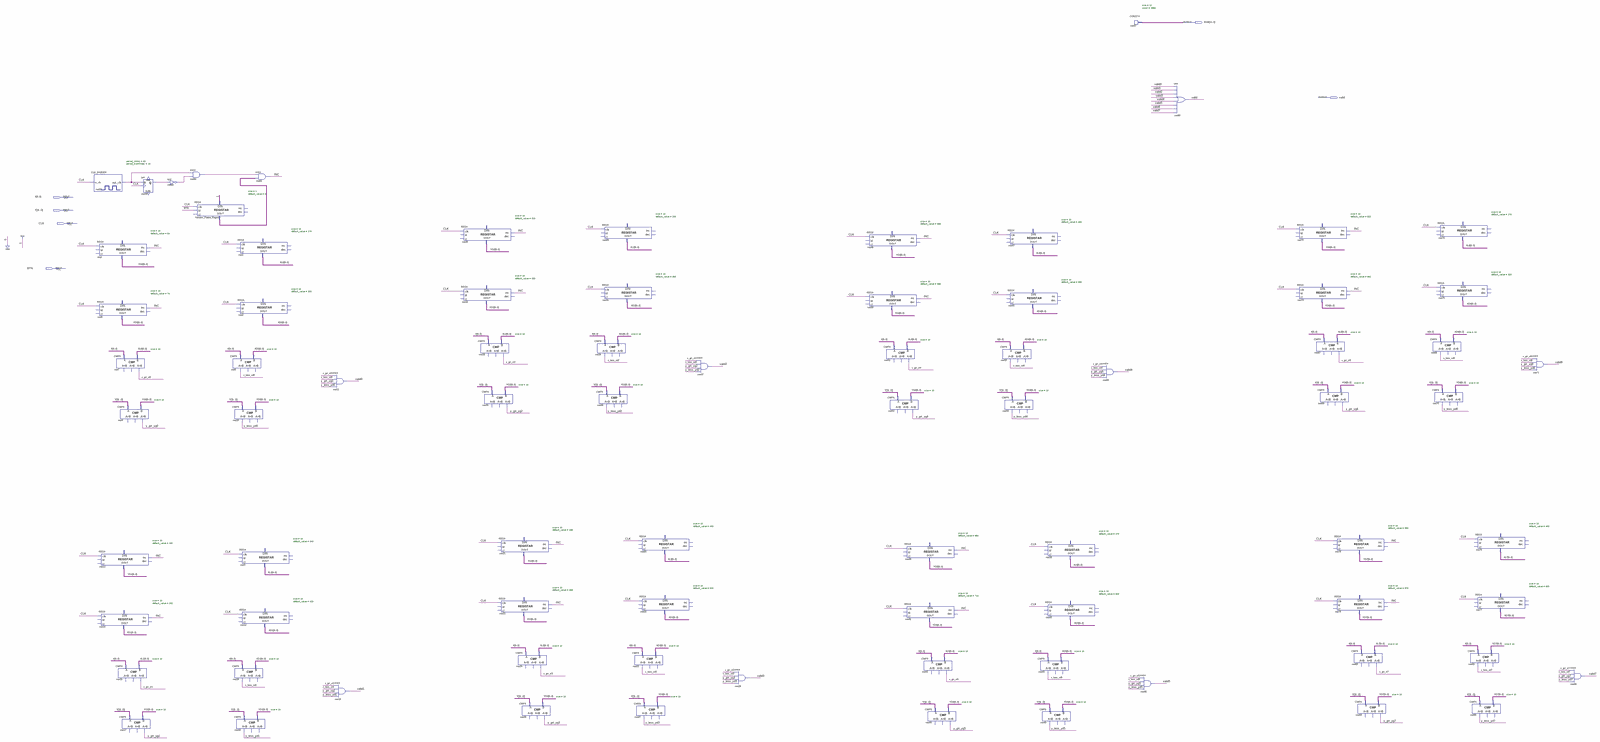
[diagram p0: schematic sheet, whole]
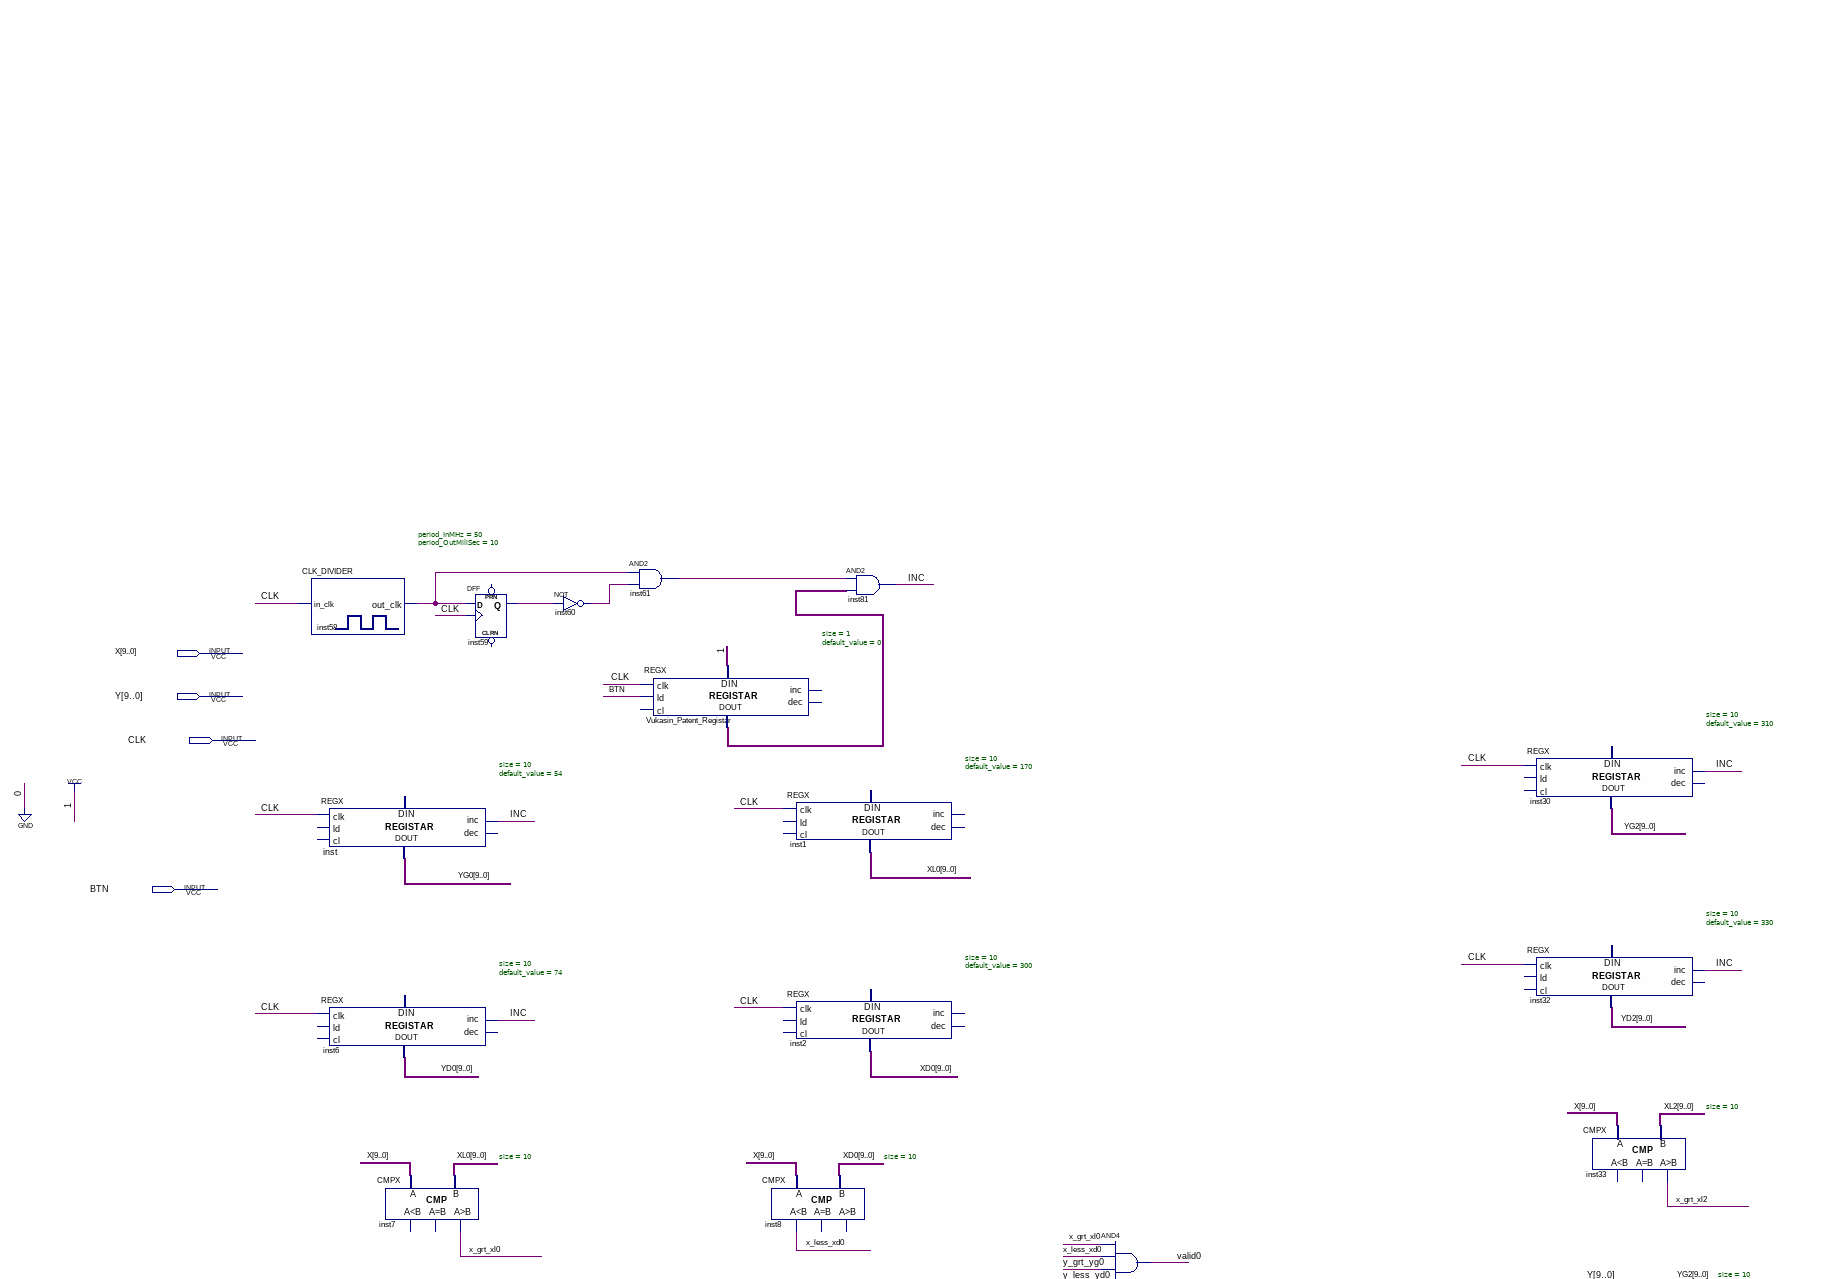
[diagram p1: schematic sheet, upper left part]
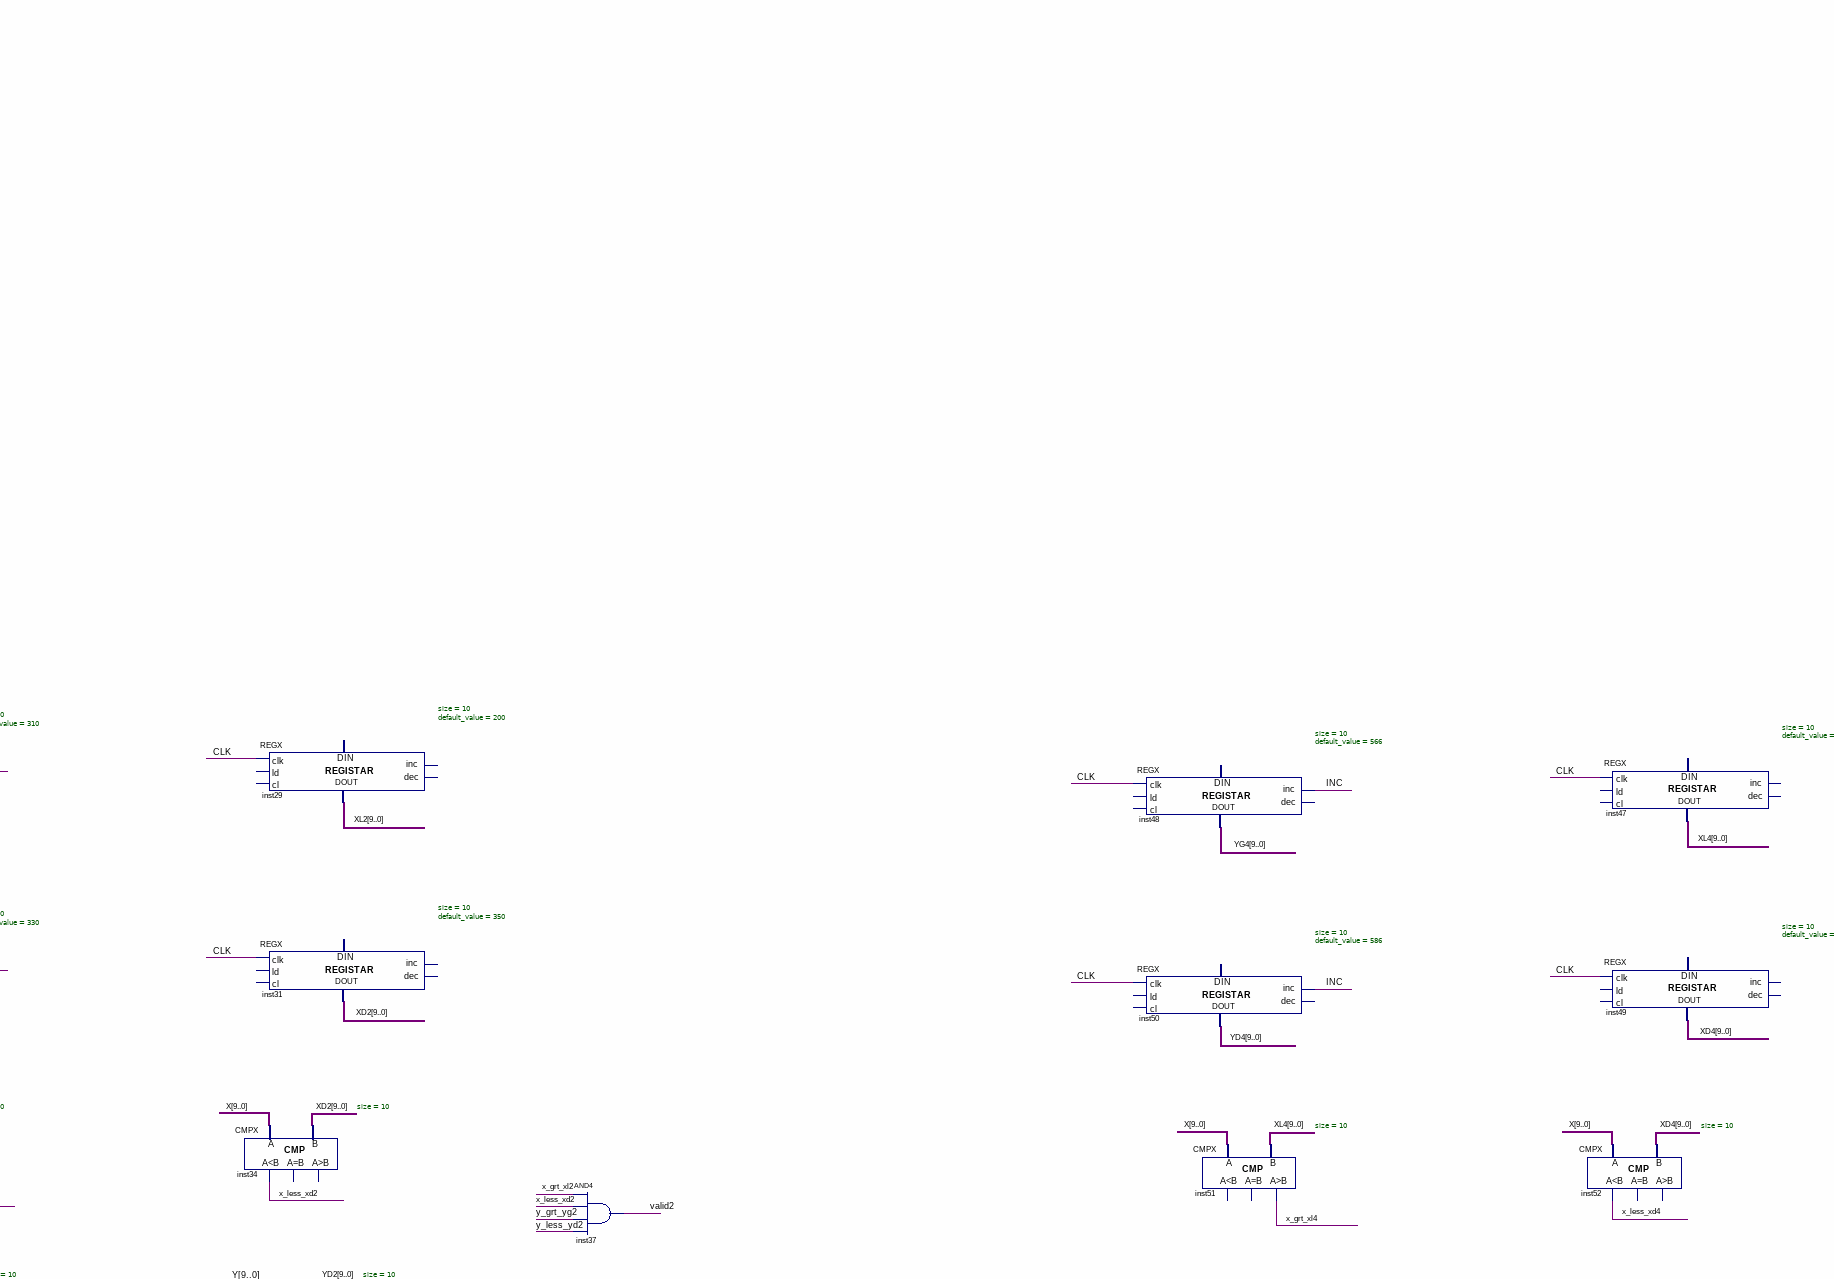
[diagram p2: schematic sheet, upper centre part]
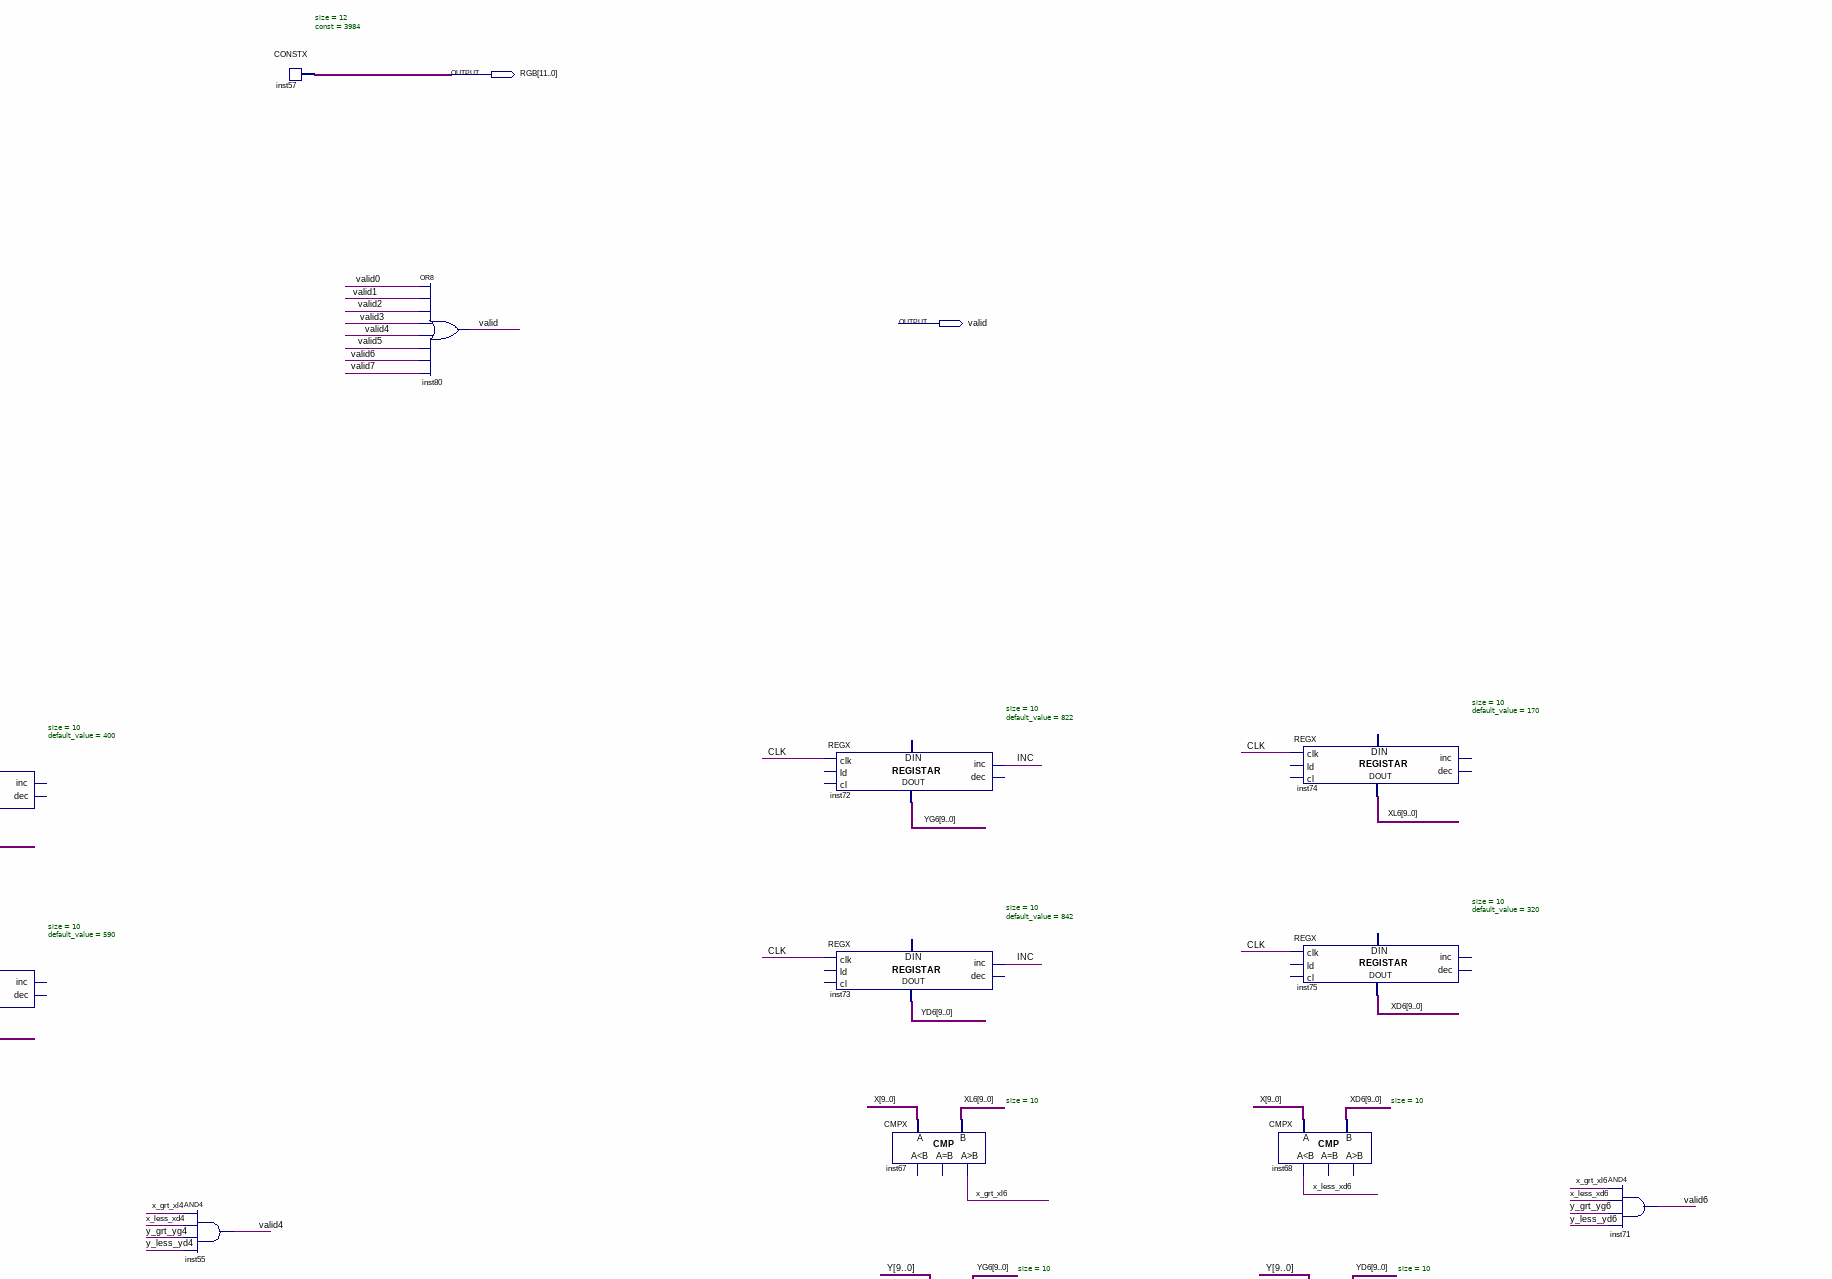
[diagram p3: schematic sheet, upper right part]
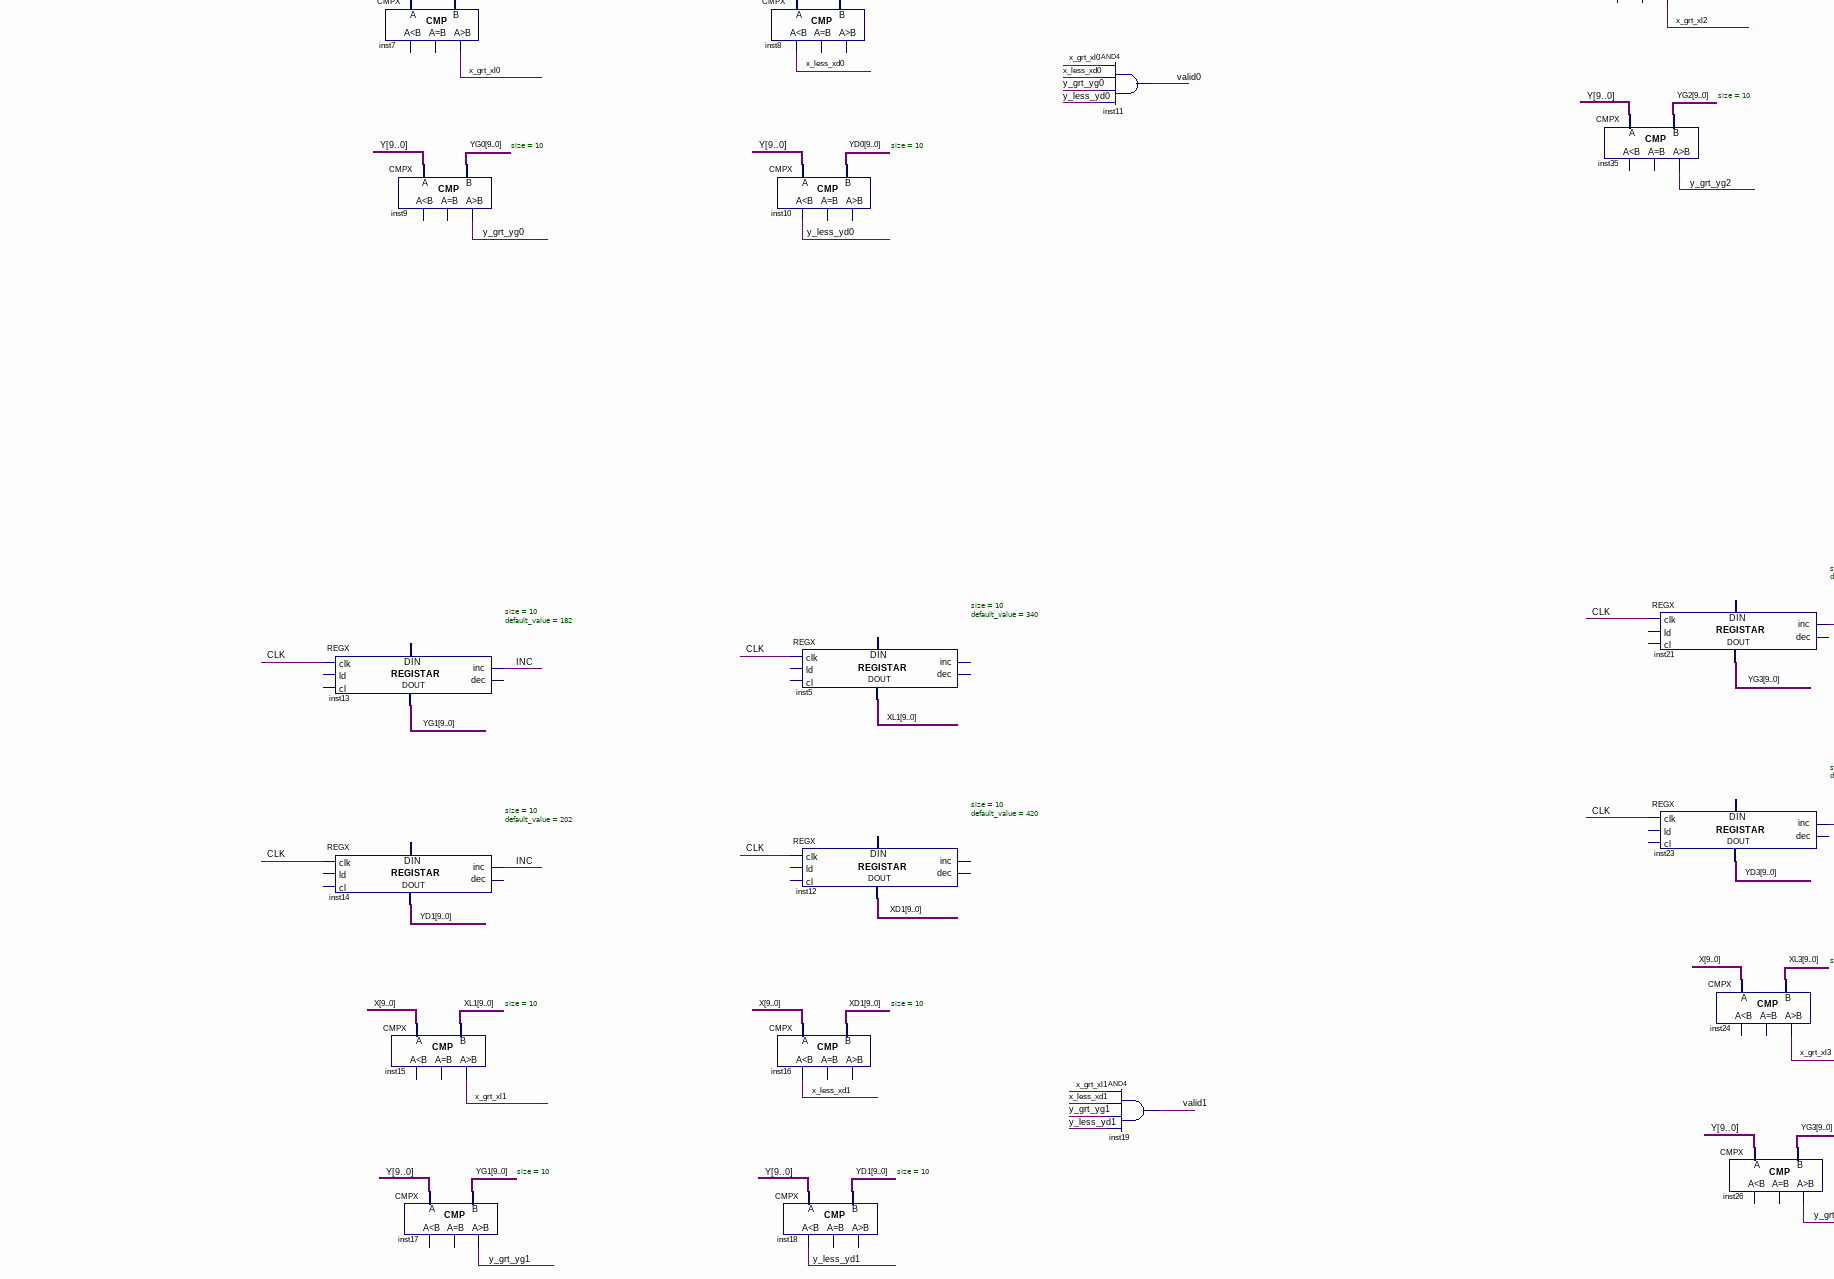
[diagram p4: schematic sheet, lower left part]
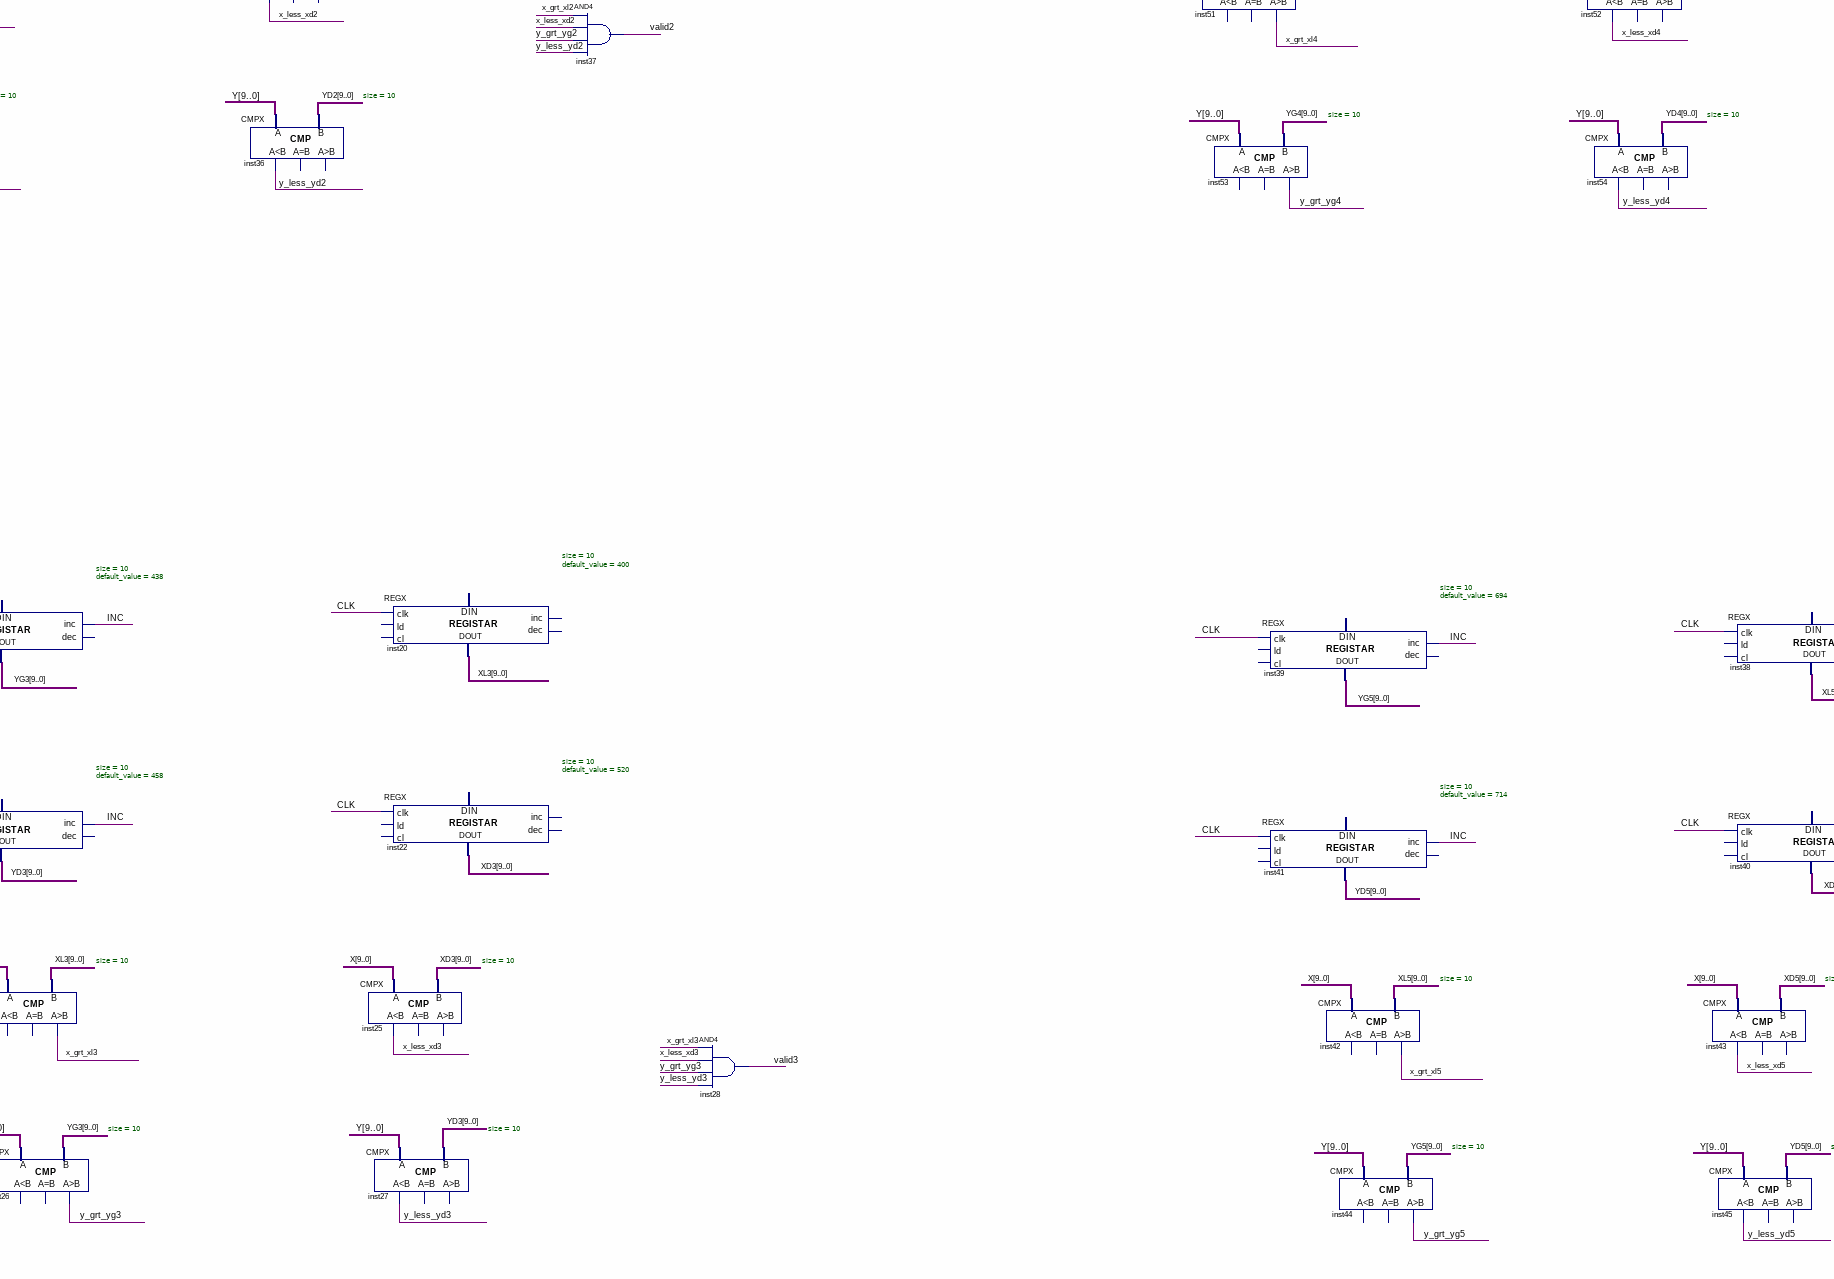
[diagram p5: schematic sheet, lower centre part]
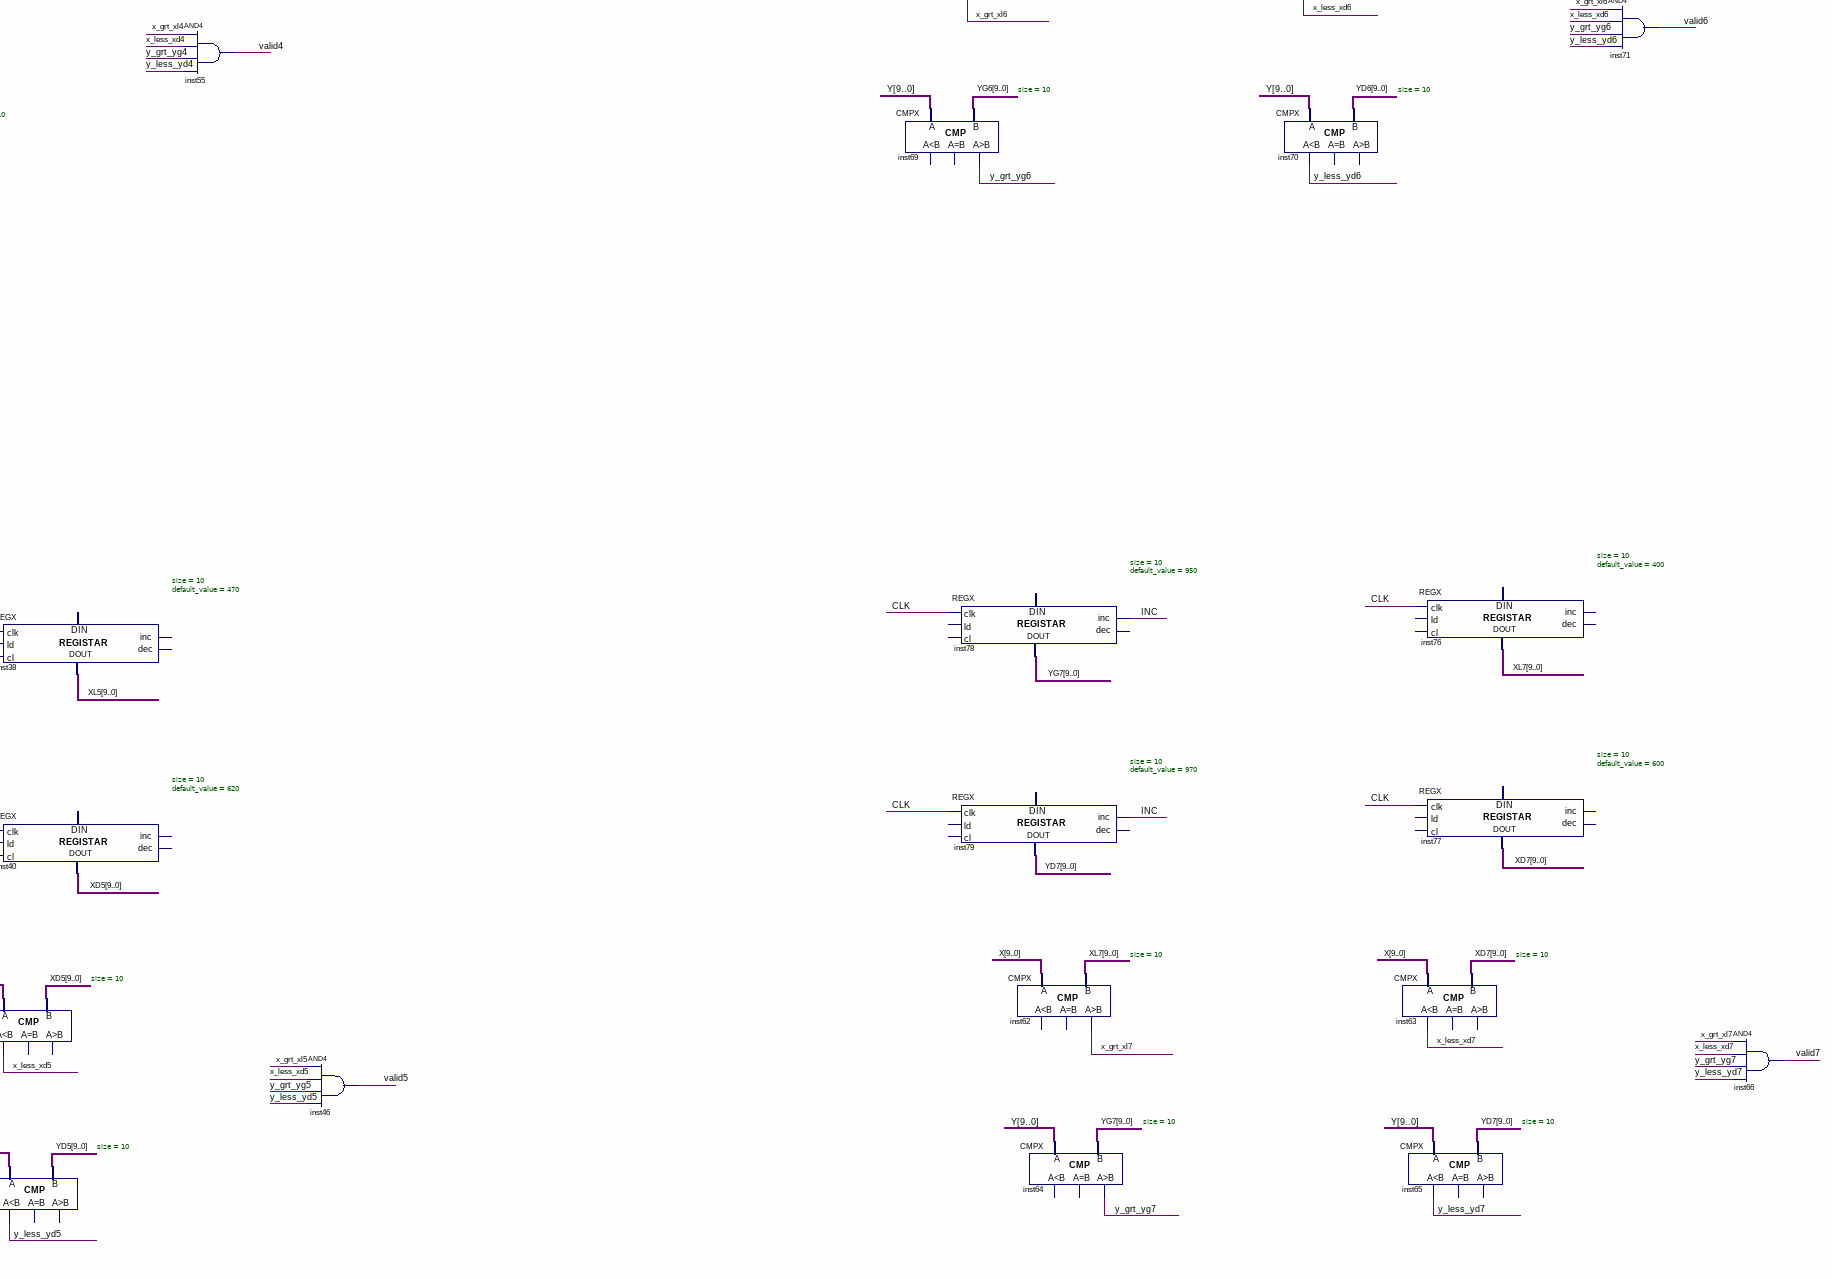
[diagram p6: schematic sheet, lower right part]
// Quartus schematic plocice.bdf as structural Verilog: 80 symbols, 6 pins
module plocice (
  input  [9:0] X,
  input  [9:0] Y,
  input  CLK,
  input  BTN,
  output [11:0] RGB,
  output valid
);

  wire INC, inst58_out_clk, inst59_q, inst60_out, inst61_out, valid0, valid1, valid2, valid3, valid4, valid5,
       valid6, valid7, Vukasin_Patent_Registar_data_out, x_grt_xl0, x_grt_xl1, x_grt_xl2, x_grt_xl3,
       x_grt_xl4, x_grt_xl5, x_grt_xl6, x_grt_xl7, x_less_xd0, x_less_xd1, x_less_xd2, x_less_xd3,
       x_less_xd4, x_less_xd5, x_less_xd6, x_less_xd7, y_grt_yg0, y_grt_yg1, y_grt_yg2, y_grt_yg3, y_grt_yg4,
       y_grt_yg5, y_grt_yg6, y_grt_yg7, y_less_yd0, y_less_yd1, y_less_yd2, y_less_yd3, y_less_yd4,
       y_less_yd5, y_less_yd6, y_less_yd7;
  wire [9:0] XD0, XD1, XD2, XD3, XD4, XD5, XD6, XD7, XL0, XL1, XL2, XL3, XL4, XL5, XL6, XL7, YD0, YD1, YD2,
       YD3, YD4, YD5, YD6, YD7, YG0, YG1, YG2, YG3, YG4, YG5, YG6, YG7;

  CLK_DIVIDER #(.period_InMHz(50), .period_OutMiliSec(10)) inst58 (.in_clk(CLK), .out_clk(inst58_out_clk));
  REGX #(.size(10), .default_value(54)) inst (.clk(CLK), .inc(INC), .data_out(YG0));  // open: ld, cl, dec, data_in
  REGX #(.size(10), .default_value(74)) inst6 (.clk(CLK), .inc(INC), .data_out(YD0));  // open: ld, cl, dec, data_in
  REGX #(.size(10), .default_value(182)) inst13 (.clk(CLK), .inc(INC), .data_out(YG1));  // open: ld, cl, dec, data_in
  REGX #(.size(10), .default_value(202)) inst14 (.clk(CLK), .inc(INC), .data_out(YD1));  // open: ld, cl, dec, data_in
  CMPX #(.size(10)) inst7 (.A(X), .B(XL0), .gr(x_grt_xl0));  // open: ls, eq
  CMPX #(.size(10)) inst9 (.A(Y), .B(YG0), .gr(y_grt_yg0));  // open: ls, eq
  CMPX #(.size(10)) inst15 (.A(X), .B(XL1), .gr(x_grt_xl1));  // open: ls, eq
  CMPX #(.size(10)) inst17 (.A(Y), .B(YG1), .gr(y_grt_yg1));  // open: ls, eq
  DFF inst59 (.CLK(CLK), .D(inst58_out_clk), .Q(inst59_q));  // open: CLRN, PRN
  not inst60 (inst60_out, inst59_q);
  and inst61 (inst61_out, inst58_out_clk, inst60_out);
  REGX #(.size(1), .default_value(0)) Vukasin_Patent_Registar (
    .clk(CLK), .ld(BTN), .data_in(1'b1), .data_out(Vukasin_Patent_Registar_data_out));  // open: cl, inc, dec
  CMPX #(.size(10)) inst8 (.A(X), .B(XD0), .ls(x_less_xd0));  // open: eq, gr
  REGX #(.size(10), .default_value(170)) inst1 (.clk(CLK), .data_out(XL0));  // open: ld, cl, inc, dec, data_in
  REGX #(.size(10), .default_value(300)) inst2 (.clk(CLK), .data_out(XD0));  // open: ld, cl, inc, dec, data_in
  CMPX #(.size(10)) inst10 (.A(Y), .B(YD0), .ls(y_less_yd0));  // open: eq, gr
  REGX #(.size(10), .default_value(340)) inst5 (.clk(CLK), .data_out(XL1));  // open: ld, cl, inc, dec, data_in
  REGX #(.size(10), .default_value(420)) inst12 (.clk(CLK), .data_out(XD1));  // open: ld, cl, inc, dec, data_in
  CMPX #(.size(10)) inst16 (.A(X), .B(XD1), .ls(x_less_xd1));  // open: eq, gr
  CMPX #(.size(10)) inst18 (.A(Y), .B(YD1), .ls(y_less_yd1));  // open: eq, gr
  and inst81 (INC, inst61_out, Vukasin_Patent_Registar_data_out);
  and inst11 (valid0, x_grt_xl0, x_less_xd0, y_grt_yg0, y_less_yd0);
  and inst19 (valid1, x_grt_xl1, x_less_xd1, y_grt_yg1, y_less_yd1);
  REGX #(.size(10), .default_value(310)) inst30 (.clk(CLK), .inc(INC), .data_out(YG2));  // open: ld, cl, dec, data_in
  REGX #(.size(10), .default_value(330)) inst32 (.clk(CLK), .inc(INC), .data_out(YD2));  // open: ld, cl, dec, data_in
  CMPX #(.size(10)) inst33 (.A(X), .B(XL2), .gr(x_grt_xl2));  // open: ls, eq
  CMPX #(.size(10)) inst35 (.A(Y), .B(YG2), .gr(y_grt_yg2));  // open: ls, eq
  REGX #(.size(10), .default_value(438)) inst21 (.clk(CLK), .inc(INC), .data_out(YG3));  // open: ld, cl, dec, data_in
  REGX #(.size(10), .default_value(458)) inst23 (.clk(CLK), .inc(INC), .data_out(YD3));  // open: ld, cl, dec, data_in
  CMPX #(.size(10)) inst24 (.A(X), .B(XL3), .gr(x_grt_xl3));  // open: ls, eq
  CMPX #(.size(10)) inst26 (.A(Y), .B(YG3), .gr(y_grt_yg3));  // open: ls, eq
  REGX #(.size(10), .default_value(200)) inst29 (.clk(CLK), .data_out(XL2));  // open: ld, cl, inc, dec, data_in
  REGX #(.size(10), .default_value(350)) inst31 (.clk(CLK), .data_out(XD2));  // open: ld, cl, inc, dec, data_in
  CMPX #(.size(10)) inst34 (.A(X), .B(XD2), .ls(x_less_xd2));  // open: eq, gr
  CMPX #(.size(10)) inst36 (.A(Y), .B(YD2), .ls(y_less_yd2));  // open: eq, gr
  CMPX #(.size(10)) inst25 (.A(X), .B(XD3), .ls(x_less_xd3));  // open: eq, gr
  CMPX #(.size(10)) inst27 (.A(Y), .B(YD3), .ls(y_less_yd3));  // open: eq, gr
  REGX #(.size(10), .default_value(400)) inst20 (.clk(CLK), .data_out(XL3));  // open: ld, cl, inc, dec, data_in
  REGX #(.size(10), .default_value(520)) inst22 (.clk(CLK), .data_out(XD3));  // open: ld, cl, inc, dec, data_in
  and inst37 (valid2, x_grt_xl2, x_less_xd2, y_grt_yg2, y_less_yd2);
  and inst28 (valid3, x_grt_xl3, x_less_xd3, y_grt_yg3, y_less_yd3);
  REGX #(.size(10), .default_value(566)) inst48 (.clk(CLK), .inc(INC), .data_out(YG4));  // open: ld, cl, dec, data_in
  REGX #(.size(10), .default_value(586)) inst50 (.clk(CLK), .inc(INC), .data_out(YD4));  // open: ld, cl, dec, data_in
  CMPX #(.size(10)) inst51 (.A(X), .B(XL4), .gr(x_grt_xl4));  // open: ls, eq
  CMPX #(.size(10)) inst53 (.A(Y), .B(YG4), .gr(y_grt_yg4));  // open: ls, eq
  REGX #(.size(10), .default_value(694)) inst39 (.clk(CLK), .inc(INC), .data_out(YG5));  // open: ld, cl, dec, data_in
  REGX #(.size(10), .default_value(714)) inst41 (.clk(CLK), .inc(INC), .data_out(YD5));  // open: ld, cl, dec, data_in
  CMPX #(.size(10)) inst42 (.A(X), .B(XL5), .gr(x_grt_xl5));  // open: ls, eq
  CMPX #(.size(10)) inst44 (.A(Y), .B(YG5), .gr(y_grt_yg5));  // open: ls, eq
  REGX #(.size(10), .default_value(400)) inst47 (.clk(CLK), .data_out(XL4));  // open: ld, cl, inc, dec, data_in
  REGX #(.size(10), .default_value(590)) inst49 (.clk(CLK), .data_out(XD4));  // open: ld, cl, inc, dec, data_in
  CMPX #(.size(10)) inst52 (.A(X), .B(XD4), .ls(x_less_xd4));  // open: eq, gr
  CMPX #(.size(10)) inst54 (.A(Y), .B(YD4), .ls(y_less_yd4));  // open: eq, gr
  CMPX #(.size(10)) inst43 (.A(X), .B(XD5), .ls(x_less_xd5));  // open: eq, gr
  CMPX #(.size(10)) inst45 (.A(Y), .B(YD5), .ls(y_less_yd5));  // open: eq, gr
  REGX #(.size(10), .default_value(470)) inst38 (.clk(CLK), .data_out(XL5));  // open: ld, cl, inc, dec, data_in
  REGX #(.size(10), .default_value(620)) inst40 (.clk(CLK), .data_out(XD5));  // open: ld, cl, inc, dec, data_in
  and inst55 (valid4, x_grt_xl4, x_less_xd4, y_grt_yg4, y_less_yd4);
  CONSTX #(.size(12), .\const (3984)) inst57 (.data(RGB));
  and inst46 (valid5, x_grt_xl5, x_less_xd5, y_grt_yg5, y_less_yd5);
  or inst80 (valid, valid0, valid1, valid2, valid3, valid4, valid5, valid6, valid7);
  REGX #(.size(10), .default_value(822)) inst72 (.clk(CLK), .inc(INC), .data_out(YG6));  // open: ld, cl, dec, data_in
  REGX #(.size(10), .default_value(842)) inst73 (.clk(CLK), .inc(INC), .data_out(YD6));  // open: ld, cl, dec, data_in
  CMPX #(.size(10)) inst67 (.A(X), .B(XL6), .gr(x_grt_xl6));  // open: ls, eq
  CMPX #(.size(10)) inst69 (.A(Y), .B(YG6), .gr(y_grt_yg6));  // open: ls, eq
  REGX #(.size(10), .default_value(950)) inst78 (.clk(CLK), .inc(INC), .data_out(YG7));  // open: ld, cl, dec, data_in
  REGX #(.size(10), .default_value(970)) inst79 (.clk(CLK), .inc(INC), .data_out(YD7));  // open: ld, cl, dec, data_in
  CMPX #(.size(10)) inst62 (.A(X), .B(XL7), .gr(x_grt_xl7));  // open: ls, eq
  CMPX #(.size(10)) inst64 (.A(Y), .B(YG7), .gr(y_grt_yg7));  // open: ls, eq
  CMPX #(.size(10)) inst68 (.A(X), .B(XD6), .ls(x_less_xd6));  // open: eq, gr
  CMPX #(.size(10)) inst70 (.A(Y), .B(YD6), .ls(y_less_yd6));  // open: eq, gr
  REGX #(.size(10), .default_value(170)) inst74 (.clk(CLK), .data_out(XL6));  // open: ld, cl, inc, dec, data_in
  REGX #(.size(10), .default_value(320)) inst75 (.clk(CLK), .data_out(XD6));  // open: ld, cl, inc, dec, data_in
  REGX #(.size(10), .default_value(400)) inst76 (.clk(CLK), .data_out(XL7));  // open: ld, cl, inc, dec, data_in
  REGX #(.size(10), .default_value(600)) inst77 (.clk(CLK), .data_out(XD7));  // open: ld, cl, inc, dec, data_in
  CMPX #(.size(10)) inst63 (.A(X), .B(XD7), .ls(x_less_xd7));  // open: eq, gr
  CMPX #(.size(10)) inst65 (.A(Y), .B(YD7), .ls(y_less_yd7));  // open: eq, gr
  and inst71 (valid6, x_grt_xl6, x_less_xd6, y_grt_yg6, y_less_yd6);
  and inst66 (valid7, x_grt_xl7, x_less_xd7, y_grt_yg7, y_less_yd7);
endmodule
